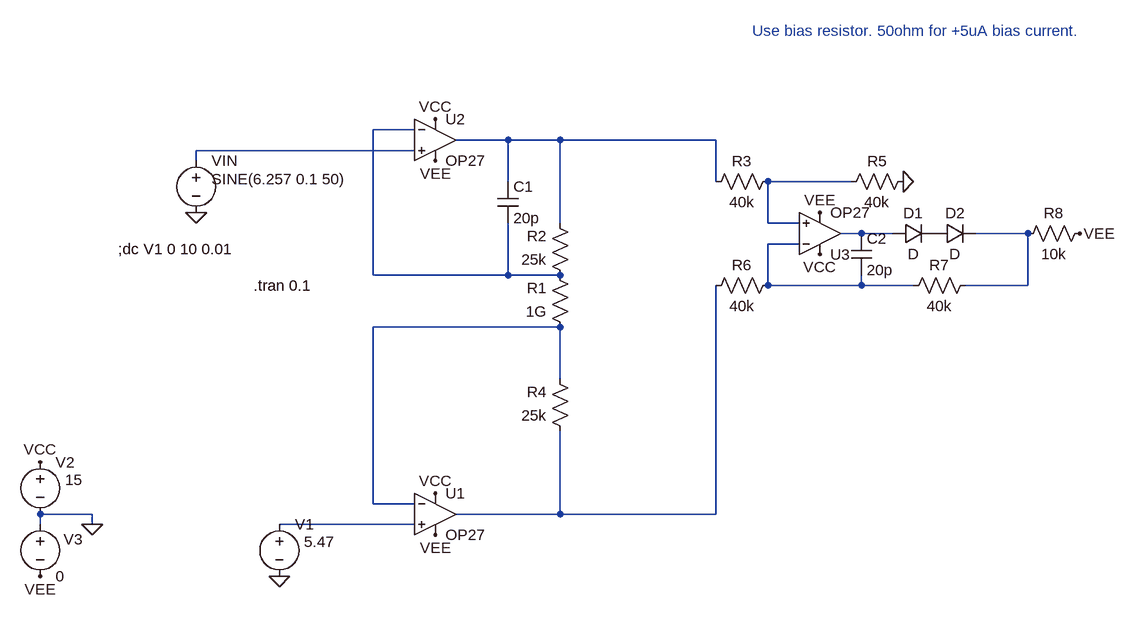
[diagram p0: schematic Draft33.asc]
Draft33.asc, the LTspice schematic file:
Version 4
SHEET 1 1472 940
WIRE 384 80 320 80
WIRE 528 96 448 96
WIRE 608 96 528 96
WIRE 848 96 608 96
WIRE 384 112 48 112
WIRE 48 128 48 112
WIRE 528 160 528 96
WIRE 848 160 848 96
WIRE 1056 160 928 160
WIRE 608 224 608 96
WIRE 928 224 928 160
WIRE 976 224 928 224
WIRE 1072 240 1040 240
WIRE 1120 240 1072 240
WIRE 1328 240 1248 240
WIRE 976 256 928 256
WIRE 320 304 320 80
WIRE 528 304 528 224
WIRE 528 304 320 304
WIRE 608 304 528 304
WIRE 928 320 928 256
WIRE 1072 320 1072 304
WIRE 1072 320 928 320
WIRE 1152 320 1072 320
WIRE 1328 320 1328 240
WIRE 1328 320 1232 320
WIRE 608 384 320 384
WIRE 608 464 608 384
WIRE 320 656 320 384
WIRE 384 656 320 656
WIRE -112 672 -192 672
WIRE 608 672 608 544
WIRE 608 672 448 672
WIRE 848 672 848 320
WIRE 848 672 608 672
WIRE -192 688 -192 672
WIRE -112 688 -112 672
WIRE 384 688 176 688
FLAG 48 208 0
FLAG -112 688 0
FLAG -192 592 VCC
FLAG 416 64 VCC
FLAG -192 768 VEE
FLAG 416 128 VEE
FLAG 416 640 VCC
FLAG 416 704 VEE
FLAG 176 768 0
FLAG 1008 272 VCC
FLAG 1008 208 VEE
FLAG 1136 160 0
FLAG 1408 240 VEE
SYMBOL voltage 48 112 R0
WINDOW 123 0 0 Left 0
WINDOW 39 0 0 Left 0
WINDOW 3 24 44 Left 2
SYMATTR Value SINE(6.257 0.1 50)
SYMATTR InstName VIN
SYMBOL voltage -192 576 R0
WINDOW 123 0 0 Left 0
WINDOW 39 0 0 Left 0
WINDOW 3 38 43 Left 2
SYMATTR Value 15
SYMATTR InstName V2
SYMBOL voltage -192 672 R0
WINDOW 123 0 0 Left 0
WINDOW 39 0 0 Left 0
WINDOW 0 36 39 Left 2
SYMATTR InstName V3
SYMATTR Value 0
SYMBOL res 624 320 R180
WINDOW 0 36 76 Left 2
WINDOW 3 36 40 Left 2
SYMATTR InstName R2
SYMATTR Value 25k
SYMBOL OpAmps\\OP27 416 32 R0
SYMATTR InstName U2
SYMBOL OpAmps\\OP27 416 608 R0
SYMATTR InstName U1
SYMBOL res 624 400 R180
WINDOW 0 36 76 Left 2
WINDOW 3 36 40 Left 2
SYMATTR InstName R1
SYMATTR Value 1G
SYMBOL res 624 560 R180
WINDOW 0 36 76 Left 2
WINDOW 3 36 40 Left 2
SYMATTR InstName R4
SYMATTR Value 25k
SYMBOL voltage 176 672 R0
WINDOW 123 0 0 Left 0
WINDOW 39 0 0 Left 0
WINDOW 3 38 43 Left 2
SYMATTR Value 5.47
SYMATTR InstName V1
SYMBOL cap 512 160 R0
SYMATTR InstName C1
SYMATTR Value 20p
SYMBOL OpAmps\\OP27 1008 304 M180
SYMATTR InstName U3
SYMBOL res 944 144 R90
WINDOW 0 0 56 VBottom 2
WINDOW 3 32 56 VTop 2
SYMATTR InstName R3
SYMATTR Value 40k
SYMBOL res 1152 144 R90
WINDOW 0 0 56 VBottom 2
WINDOW 3 32 56 VTop 2
SYMATTR InstName R5
SYMATTR Value 40k
SYMBOL res 944 304 R90
WINDOW 0 0 56 VBottom 2
WINDOW 3 32 56 VTop 2
SYMATTR InstName R6
SYMATTR Value 40k
SYMBOL res 1248 304 R90
WINDOW 0 0 56 VBottom 2
WINDOW 3 32 56 VTop 2
SYMATTR InstName R7
SYMATTR Value 40k
SYMBOL cap 1056 240 R0
SYMATTR InstName C2
SYMATTR Value 20p
SYMBOL diode 1120 256 R270
WINDOW 0 32 32 VTop 2
WINDOW 3 0 32 VBottom 2
SYMATTR InstName D1
SYMBOL res 1424 224 R90
WINDOW 0 0 56 VBottom 2
WINDOW 3 32 56 VTop 2
SYMATTR InstName R8
SYMATTR Value 10k
SYMBOL diode 1184 256 R270
WINDOW 0 32 32 VTop 2
WINDOW 3 0 32 VBottom 2
SYMATTR InstName D2
TEXT -72 264 Left 2 !;dc V1 0 10 0.01
TEXT 136 320 Left 2 !.tran 0.1
TEXT 904 -72 Left 2 ;Use bias resistor. 50ohm for +5uA bias current.

The netlist it stands for:
* Draft33.asc
VIN N003 0 SINE(6.257 0.1 50)
V2 VCC 0 15
V3 0 VEE 0
R2 N001 N002 25k
XU2 N003 N001 VCC VEE N002 OP27  ; pins In+ In- V+ V- OUT
XU1 N010 N008 VCC VEE N009 OP27  ; pins In+ In- V+ V- OUT
R1 N008 N001 1G
R4 N009 N008 25k
V1 N010 0 5.47
C1 N002 N001 20p
XU3 N004 N007 VCC VEE N005 OP27  ; pins In+ In- V+ V- OUT
R3 N004 N002 40k
R5 0 N004 40k
R6 N007 N009 40k
R7 N006 N007 40k
C2 N005 N007 20p
D1 N005 P001 D
R8 VEE N006 10k
D2 P001 N006 D
.model D D
.lib standard.dio
;dc V1 0 10 0.01
.tran 0.1
* Use bias resistor. 50ohm for +5uA bias current.
.lib ADI.lib
.backanno
.end